# Altium schematic sheet MCU.SchDoc
size A3; SheetNumber: 2; SheetTotal: 5
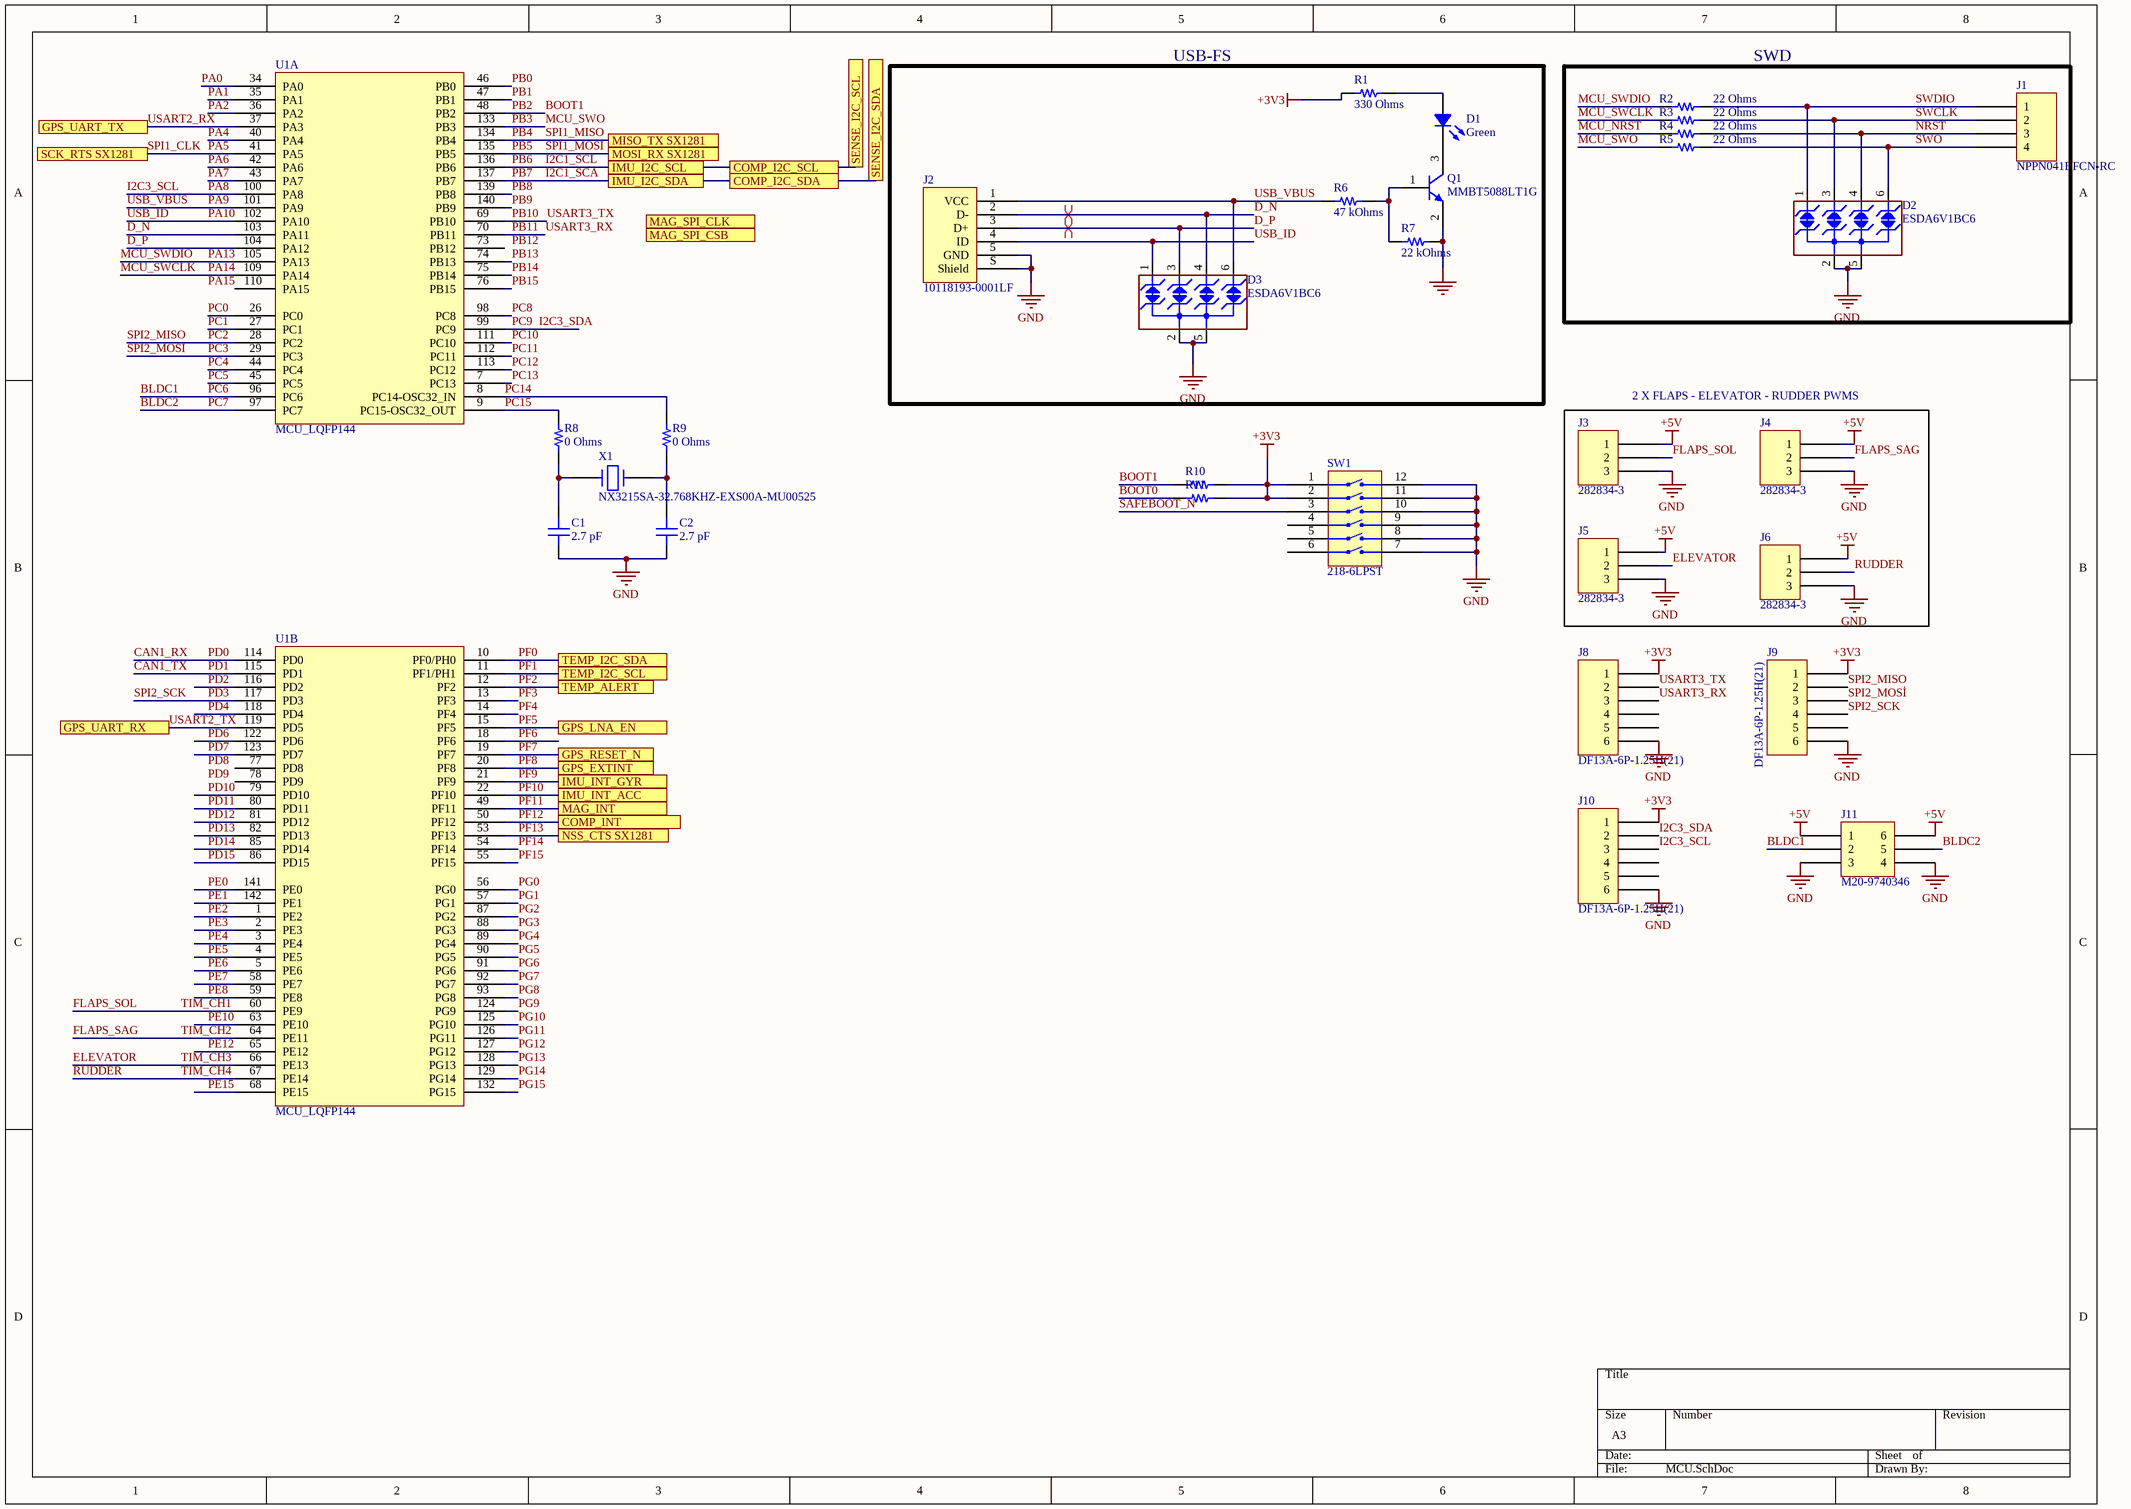
[diagram p0: MCU.SchDoc]

## Parts
C1  2.7 pF  [CAP 0603_1608]
C2  2.7 pF  [CAP 0603_1608]
D1  Green  [LED 0603_1608 GREEN]
D2  ESDA6V1BC6  [SOT23-6L_STM]
D3  ESDA6V1BC6  [SOT23-6L_STM]
J1  NPPN041BFCN-RC  [SULLINS NPPN041BFCN]
J2  10118193-0001LF  [FCI USB 10118193-0001LF]
J3  282834-3  [TE 282834-3]
J4  282834-3  [TE 282834-3]
J5  282834-3  [TE 282834-3]
J6  282834-3  [TE 282834-3]
J8  DF13A-6P-1.25H(21)  [HIROSE DF13A-6P-1.25H]
J9  DF13A-6P-1.25H(21)  [HIROSE DF13A-6P-1.25H]
J10  DF13A-6P-1.25H(21)  [HIROSE DF13A-6P-1.25H]
J11  M20-9740346  [HARWIN M20-9740345]
Q1  MMBT5088LT1G  [ON SEMI SOT-23-3]
R1  330 Ohms  [RES 0603_1608]
R2  22 Ohms  [RES 0603_1608]
R3  22 Ohms  [RES 0603_1608]
R4  22 Ohms  [RES 0603_1608]
R5  22 Ohms  [RES 0603_1608]
R6  47 kOhms  [RES 0603_1608]
R7  22 kOhms  [RES 0603_1608]
R8  0 Ohms  [RES 0603_1608]
R9  0 Ohms  [RES 0603_1608]
R10  100 kOhms  [RES 0603_1608]  (value not drawn)
R11  10 kOhms  [RES 0603_1608]  (value not drawn)
SW1  218-6LPST  [CTS 218-6LPJ]
U1  MCU_LQFP144  [LQFP144_0R5_SKT]  (parts A,B of 3)
X1  NX3215SA-32.768KHZ-EXS00A-MU00525  [XTAL_NX3215SA-32.768KHZ-EXS00A-MU00525_NDK]

## Blocks framed on the sheet
USB-FS: D1 D3 J2 Q1 R1 R6 R7
SWD: D2 J1 R2-R5
2 X FLAPS - ELEVATOR - RUDDER PWMS: J3-J6

## Ports
COMP_I2C_SCL, COMP_I2C_SDA, COMP_INT, GPS_EXTINT, GPS_LNA_EN, GPS_RESET_N, GPS_UART_RX, GPS_UART_TX, IMU_I2C_SCL, IMU_I2C_SDA, IMU_INT_ACC, IMU_INT_GYR, MAG_INT, MAG_SPI_CLK, MAG_SPI_CSB, MISO_TX SX1281, MOSI_RX SX1281, NSS_CTS SX1281, SCK_RTS SX1281, SENSE_I2C_SCL, SENSE_I2C_SDA, TEMP_ALERT, TEMP_I2C_SCL, TEMP_I2C_SDA

## Nets
+3V3: J8.1 J9.1 J10.1 R1.2 R10.2 R11.2 SW1.1(GND) SW1.2(GND)
+5V: J3.1 J4.1 J5.1 J6.1 J11.1 J11.6
GND: C1.1 C2.1 D2.2(IO2) D2.5(IO4) D3.2(IO2) D3.5(IO4) J2.5(GND) J2.S(Shield) J3.3 J4.3 J5.3 J6.3 J8.6 J9.6 J10.6 J11.3 J11.4 Q1.2(E) R7.2 SW1.7 SW1.8 SW1.9 SW1.10 SW1.11 SW1.12
BLDC1: J11.2 U1.96(PC6)  [also labelled PC6]
BLDC2: J11.5 U1.97(PC7)  [also labelled PC7]
BOOT0: R11.1
BOOT1: R10.1 U1.48(PB2)  [also labelled PB2]
CAN1_RX: U1.114(PD0)  [also labelled PD0]
CAN1_TX: U1.115(PD1)  [also labelled PD1]
D_N: D3.4(IO3) J2.2(D-) U1.103(PA11)
D_P: D3.3(GND) J2.3(D+) U1.104(PA12)
ELEVATOR: J5.2 U1.66(PE13)  [also labelled TIM_CH3]
FLAPS_SAG: J4.2 U1.64(PE11)  [also labelled TIM_CH2]
FLAPS_SOL: J3.2 U1.60(PE9)  [also labelled TIM_CH1]
I2C1_SCA: U1.137(PB7) ; port IMU_I2C_SDA, port SENSE_I2C_SDA, port COMP_I2C_SDA  [also labelled PB7]
I2C1_SCL: U1.136(PB6) ; port IMU_I2C_SCL, port COMP_I2C_SCL, port SENSE_I2C_SCL  [also labelled PB6]
I2C3_SCL: J10.3 U1.100(PA8)  [also labelled PA8]
I2C3_SDA: J10.2 U1.99(PC9)  [also labelled PC9]
MCU_NRST: R4.1
MCU_SWCLK: R3.1 U1.109(PA14)  [also labelled PA14]
MCU_SWDIO: R2.1 U1.105(PA13)  [also labelled PA13]
MCU_SWO: R5.1 U1.133(PB3)  [also labelled PB3]
NRST: D2.4(IO3) J1.3 R4.2
PA0: U1.34(PA0)
PA1: U1.35(PA1)
PA2: U1.36(PA2)
PA4: U1.40(PA4)
PA5: U1.41(PA5) ; port SCK_RTS SX1281  [also labelled SPI1_CLK]
PA6: U1.42(PA6)
PA7: U1.43(PA7)
PA9: D3.6(NC) J2.1(VCC) R6.1 U1.101(PA9)  [also labelled USB_VBUS]
PA10: D3.1(IO1) J2.4(ID) U1.102(PA10)  [also labelled USB_ID]
PB0: U1.46(PB0)
PB1: U1.47(PB1)
PB4: U1.134(PB4) ; port MISO_TX SX1281  [also labelled SPI1_MISO]
PB5: U1.135(PB5) ; port MOSI_RX SX1281  [also labelled SPI1_MOSI]
PB8: U1.139(PB8)
PB9: U1.140(PB9)
PB10: J8.2 U1.69(PB10)  [also labelled USART3_TX]
PB11: J8.3 U1.70(PB11)  [also labelled USART3_RX]
PB13: U1.74(PB13)
PB14: U1.75(PB14)
PB15: U1.76(PB15)
PC0: U1.26(PC0)
PC1: U1.27(PC1)
PC2: J9.2 U1.28(PC2)  [also labelled SPI2_MISO]
PC3: J9.3 U1.29(PC3)  [also labelled SPI2_MOSİ]
PC4: U1.44(PC4)
PC5: U1.45(PC5)
PC8: U1.98(PC8)
PC10: U1.111(PC10)
PC11: U1.112(PC11)
PC12: U1.113(PC12)
PC13: U1.7(PC13)
PC14: R9.2 U1.8(PC14-OSC32_IN)
PC15: R8.2 U1.9(PC15-OSC32_OUT)
PD2: U1.116(PD2)
PD3: J9.4 U1.117(PD3)  [also labelled SPI2_SCK]
PD4: U1.118(PD4)
PD6: U1.122(PD6)
PD7: U1.123(PD7)
PD10: U1.79(PD10)
PD11: U1.80(PD11)
PD12: U1.81(PD12)
PD13: U1.82(PD13)
PD14: U1.85(PD14)
PD15: U1.86(PD15)
PE0: U1.141(PE0)
PE1: U1.142(PE1)
PE2: U1.1(PE2)
PE3: U1.2(PE3)
PE4: U1.3(PE4)
PE5: U1.4(PE5)
PE6: U1.5(PE6)
PE7: U1.58(PE7)
PE8: U1.59(PE8)
PE10: U1.63(PE10)
PE12: U1.65(PE12)
PE15: U1.68(PE15)
PF0: U1.10(PF0/PH0) ; port TEMP_I2C_SDA
PF1: U1.11(PF1/PH1) ; port TEMP_I2C_SCL
PF2: U1.12(PF2) ; port TEMP_ALERT
PF3: U1.13(PF3)
PF4: U1.14(PF4)
PF5: U1.15(PF5) ; port GPS_LNA_EN
PF6: U1.18(PF6)
PF7: U1.19(PF7) ; port GPS_RESET_N
PF8: U1.20(PF8) ; port GPS_EXTINT
PF9: U1.21(PF9) ; port IMU_INT_GYR
PF10: U1.22(PF10) ; port IMU_INT_ACC
PF11: U1.49(PF11) ; port MAG_INT
PF12: U1.50(PF12) ; port COMP_INT
PF13: U1.53(PF13) ; port NSS_CTS SX1281
PF14: U1.54(PF14)
PF15: U1.55(PF15)
PG0: U1.56(PG0)
PG1: U1.57(PG1)
PG2: U1.87(PG2)
PG3: U1.88(PG3)
PG4: U1.89(PG4)
PG5: U1.90(PG5)
PG6: U1.91(PG6)
PG7: U1.92(PG7)
PG8: U1.93(PG8)
PG9: U1.124(PG9)
PG10: U1.125(PG10)
PG11: U1.126(PG11)
PG12: U1.127(PG12)
PG13: U1.128(PG13)
PG14: U1.129(PG14)
PG15: U1.132(PG15)
RUDDER: J6.2 U1.67(PE14)  [also labelled TIM_CH4]
SAFEBOOT_N: SW1.3(GND)
SWCLK: D2.3(GND) J1.2 R3.2
SWDIO: D2.1(IO1) J1.1 R2.2
SWO: D2.6(NC) J1.4 R5.2
USART2_RX: U1.37(PA3) ; port GPS_UART_TX
USART2_TX: U1.119(PD5) ; port GPS_UART_RX
NetC1_2: C1.2 R8.1 X1.1
NetC2_2: C2.2 R9.1 X1.2
NetD1_1: D1.1 R1.1
NetD1_2: D1.2 Q1.3(C)
NetQ1_1: Q1.1(B) R6.2 R7.1

Not connected (* = marked no-connect by the designer): J8 4 5; J9 5; J10 4 5; SW1 4(GND) 5 6; U1 73(PB12) 77(PD8) 78(PD9) 110(PA15)

## Layout directives
differential pair; differential pair class diff90: D_N, D_P

## Notes on the sheet
- Labels drawn without touching a wire or pin: PA15, PB12, PD8, PD9

## Library data of the parts
C1 C2 = CC0603BRNPO9BN2R7: CAP CER 2.7PF 50V C0G/NPO 0603; manufacturer: Yageo; Temperature Coefficient: C0G, NP0; Tolerance: ±0.1pF; Part Number: CC0603BRNPO9BN2R7; Value: 2.7 pF; Applications: General Purpose; Capacitance: 2.7 pF; componentlink1description: Datasheet; componentlink1url: https://www.yageo.com/upload/media/product/productsearch/datasheet/mlcc/UPY-GP_NP0_16V-to-50V_17.pdf; componentlink2description: DigiKey Link; componentlink2url: https://www.digikey.com/en/products/detail/yageo/CC0603BRNPO9BN2R7/5883424; Device Package: 0603 (1608 Metric); lastupdated: 20.02.2023 20:07:46; Lifecycle Status: Active; Minimum Order: 1; Mounting Type: Surface Mount, MLCC; Operating Temperature: -55°C ~ 125°C; Package / Case: 0603 (1608 Metric); packaging: TapeAndReel; partid: 44743; Part Status: Active; price: 0.01; series: CC; Size / Dimension: 0.063" L x 0.031" W (1.60mm x 0.80mm); Supplier 1: DigiKey; Supplier Part Number 1: 311-3830-1-ND; Thickness (Max): 0.035" (0.90mm); Voltage - Rated: 50V
D1 = HSMG-C197: LED GREEN DIFFUSED CHIP SMD; Manufacturer: Broadcom Limited; Configuration: Standard; Current - Test: 20mA; Lens Color: White; Lens Size: 1.60mm x 0.80mm; Lens Style: Rectangle with Flat Top; Millicandela Rating: 15mcd; Viewing Angle: 130°; Voltage - Forward (Vf) (Typ): 2.2V; Wavelength - Dominant: 572nm; Wavelength - Peak: 570nm; Part Number: HSMG-C197; Color: Green; ComponentLink1Description: Datasheet; ComponentLink1URL: https://docs.broadcom.com/docs/AV02-0551EN; ComponentLink2Description: DigiKey Link; ComponentLink2URL: https://www.digikey.com/en/products/detail/broadcom-limited/HSMG-C197/1235343; Device Package: 0603 (1608 Metric); Height (Max): 0.40mm; LastUpdated: 20.06.2022 12:31:27; Lens Transparency: Diffused; Lifecycle Status: Active; Minimum Order: 1; Mounting Type: Surface Mount; Package / Case: 0603 (1608 Metric); Packaging: TapeAndReel; PartId: 585; Part Status: Active; Price: 0.07; Series: -; Size / Dimension: 1.60mm L x 0.80mm W; Supplier 1: DigiKey; Supplier Part Number 1: 516-2830-1-ND; Supplier Device Package: Chip LED; Value: Green
D2 D3 = ESDA6V1BC6: 4-line ESD protection; Manuf_1: STM; Manuf_Part_1: ESDA5V3L; Ref St: 9179034; Provided: ST; ECCN_US/EU: EAR99/NEC; Distrib: ST; Order: ESDA5V3L; Ordered by: STM
J1 = NPPN041BFCN-RC: CONN HDR 4POS 0.079 GOLD PCB; Manufacturer: Sullins Connector Solutions; Connector Type: Header; Contact Length - Post: 0.094" (2.40mm); Current Rating (Amps): 2A; Material Flammability Rating: UL94 V-0; Number of Positions: 4; Number of Positions Loaded: All; Pitch - Mating: 0.079" (2.00mm); Style: Board to Board; Part Number: NPPN041BFCN-RC; ComponentLink1Description: Datasheet; ComponentLink1URL: https://drawings-pdf.s3.amazonaws.com/10483.pdf; ComponentLink2Description: DigiKey Link; ComponentLink2URL: https://www.digikey.com/en/products/detail/sullins-connector-solutions/NPPN041BFCN-RC/804806; Contact Finish - Mating: Gold; Contact Finish - Post: Gold; Contact Finish Thickness - Mating: Flash; Contact Type: Female Socket; Fastening Type: Push-Pull; Insulation Color: Black; Insulation Height: 0.173" (4.40mm); LastUpdated: 21.06.2022 14:42:51; Lifecycle Status: Active; Minimum Order: 1; Mounting Type: Through Hole; Number of Rows: 1; Operating Temperature: -40°C ~ 105°C; Packaging: Tube; Part Status: Active; Price: 0.30; Series: -; Supplier 1: DigiKey; Supplier Part Number 1: S5751-04-ND; Termination: Solder
J2 = 10118193-0001LF: CONN RCPT USB2.0 MICRO B SMD R/A; Manufacturer: Amphenol ICC (FCI); Connector Type: USB - micro B; Current Rating (Amps): 1.8A per Contact; Gender: Receptacle; Mating Cycles: 10000; Number of Contacts: 5; Number of Ports: 1; Shielding: Shielded; Voltage - Rated: 100VAC; Part Number: 10118193-0001LF; ComponentLink1Description: Datasheet; ComponentLink1URL: https://cdn.amphenol-icc.com/media/wysiwyg/files/documentation/datasheet/inputoutput/io_usb_micro.pdf; ComponentLink2Description: DigiKey Link; ComponentLink2URL: //digikey.com/product-detail/en/amphenol-icc-fci/10118193-0001LF/609-4616-2-ND/2785388; Features: Solder Retention; LastUpdated: 9.12.2019 20:51:28; Lifecycle Status: 0; Minimum Order: 1; Mounting Feature: Horizontal; Mounting Type: Surface Mount, Right Angle; Through Hole; Operating Temperature: -30°C ~ 80°C; Packaging: TapeAndReel; Part Status: Active; Price: 0.21; Series: -; Specifications: USB 2.0; Supplier 1: DigiKey; Supplier Part Number 1: 609-4616-2-ND; Termination: Solder
J3-J6 = 282834-3: TERM BLK 3P SIDE ENT 2.54MM PCB; Manufacturer: TE Connectivity AMP Connectors; Current: 10A; Mating Orientation: Horizontal with Board; Number of Levels: 1; Pitch: 0.100" (2.54mm); Positions Per Level: 3; Voltage: 150V; Wire Gauge: 16-30 AWG; Wire Termination: Screw - Rising Cage Clamp; Part Number: 282834-3; Color: Green; ComponentLink1Description: Datasheet; ComponentLink1URL: https://www.te.com/commerce/DocumentDelivery/DDEController?Action=srchrtrv&DocNm=282834&DocType=Customer+Drawing&DocLang=English; ComponentLink2Description: DigiKey Link; ComponentLink2URL: http://digikey.com/product-detail/en/te-connectivity-amp-connectors/282834-3/A98334-ND/1153264; LastUpdated: 15.01.2020 04:15:50; Lifecycle Status: Active; Minimum Order: 1; Mounting Type: Through Hole; Packaging: Bulk; Part Status: Active; Price: 2.01; Series: Buchanan; Supplier 1: DigiKey; Supplier Part Number 1: A98334-ND
J8-J10 = DF13A-6P-1.25H(21): CONN HEADER SMD R/A 6POS 1.25MM; Manufacturer: Hirose Electric Co Ltd; Current Rating (Amps): 1A; Material Flammability Rating: UL94 V-0; Number of Positions: 6; Number of Positions Loaded: All; Pitch - Mating: 0.049" (1.25mm); Shrouding: Shrouded - 4 Wall; Style: Board to Cable/Wire; Voltage Rating: 150V; Part Number: DF13A-6P-1.25H(21); ComponentLink1Description: Datasheet; ComponentLink1URL: https://www.hirose.com/product/download/?distributor=digikey&type=specSheet&lang=en&num=DF13A-6P-1.25H(21); ComponentLink2Description: DigiKey Link; ComponentLink2URL: http://digikey.com/product-detail/en/hirose-electric-co-ltd/DF13A-6P-1.25H-21/H125991CT-ND/9489729; Connector Type: Header; Contact Finish - Mating: Tin; Contact Finish - Post: Tin; Contact Material: Brass; Contact Shape: Square; Contact Type: Male Pin; Fastening Type: Detent Lock; Features: Solder Retention; Insulation Color: Beige; Insulation Height: 0.142" (3.60mm); Insulation Material: Polyamide (PA), Nylon; LastUpdated: 15.01.2020 03:36:36; Lifecycle Status: Active; Minimum Order: 1; Mounting Type: Surface Mount, Right Angle; Number of Rows: 1; Operating Temperature: -35°C ~ 85°C; Packaging: TapeAndReel; PartId: 110; Part Status: Active; Price: 0.32; Series: DF13; Supplier 1: DigiKey; Supplier Part Number 1: H125991CT-ND; Termination: Solder
J11 = M20-9740346: CONN HEADER R/A 6POS 2.54MM; Manufacturer: Harwin Inc.; Connector Type: Header, Cuttable; Current Rating (Amps): 3A per Contact; Material Flammability Rating: UL94 V-0; Number of Positions: 6; Number of Positions Loaded: All; Shrouding: Unshrouded; Style: Board to Board or Cable; Part Number: M20-9740346; ComponentLink1Description: Datasheet; ComponentLink1URL: https://cdn.harwin.com/pdfs/M20-974.pdf; ComponentLink2Description: DigiKey Link; ComponentLink2URL: http://digikey.com/product-detail/en/harwin-inc/M20-9740346/M20-9740346-ND/3920713; Contact Finish - Mating: Tin; Contact Finish - Post: Tin; Contact Material: Brass; Contact Shape: Square; Contact Type: Male Pin; Fastening Type: Push-Pull; Insulation Color: Black; Insulation Material: Polyamide (PA6T), Nylon 6T; LastUpdated: 21.09.2022 19:29:59; Lifecycle Status: Active; Minimum Order: 4000; Mounting Type: Through Hole, Right Angle; Number of Rows: 2; Operating Temperature: -40°C ~ 105°C; Packaging: Bulk; PartId: 156; Part Status: Active; Price: 0.10; Series: M20; Supplier 1: DigiKey; Supplier Part Number 1: M20-9740346-ND; Termination: Solder
Q1 = MMBT5088LT1G: TRANS NPN 30V 0.05A SOT23; Manufacturer: ON Semiconductor; Current - Collector Cutoff (Max): 50nA (ICBO); Current - Collector (Ic) (Max): 50mA; DC Current Gain (hFE) (Min) @ Ic, Vce: 300 @ 100µA, 5V; Frequency - Transition: 50MHz; Power - Max: 300mW; Vce Saturation (Max) @ Ib, Ic: 500mV @ 1mA, 10mA; Part Number: MMBT5088LT1G; ComponentLink1Description: Datasheet; ComponentLink1URL: http://www.onsemi.com/pub/Collateral/MMBT5088LT1-D.PDF; ComponentLink2Description: DigiKey Link; ComponentLink2URL: http://digikey.com/product-detail/en/on-semiconductor/MMBT5088LT1G/MMBT5088LT1GOSCT-ND/1139822; LastUpdated: 20.06.2022 12:43:40; Lifecycle Status: Active; Minimum Order: 1; Mounting Type: Surface Mount; Operating Temperature: -55°C ~ 150°C (TJ); Package / Case: TO-236-3, SC-59, SOT-23-3; Packaging: TapeAndReel; PartId: 231; Part Status: Active; Price: 0.03; Series: -; Supplier 1: DigiKey; Supplier Part Number 1: MMBT5088LT1GOSCT-ND; Supplier Device Package: SOT-23-3 (TO-236); Transistor Type: NPN; Voltage - Collector Emitter Breakdown (Max): 30V
R1 = RC0603FR-07330RL: RES 330 OHM 1% 1/10W 0603; Manufacturer: Yageo; Power (Watts): 0.1W, 1/10W; Temperature Coefficient: ±100ppm/°C; Part Number: RC0603FR-07330RL; Value: 330 Ohms; ComponentLink1Description: Datasheet; ComponentLink1URL: https://www.yageo.com/upload/media/product/productsearch/datasheet/rchip/PYu-RC_Group_51_RoHS_L_10.pdf; ComponentLink2Description: DigiKey Link; ComponentLink2URL: https://www.digikey.com/en/products/detail/yageo/RC0603FR-07330RL/727162; Composition: Thick Film; Device Package: 0603 (1608 Metric); Features: Moisture Resistant; Height - Seated (Max): 0.022" (0.55mm); LastUpdated: 20.06.2022 12:09:48; Lifecycle Status: Active; Minimum Order: 1; Number of Terminations: 2; Operating Temperature: -55°C ~ 155°C; Package / Case: 0603 (1608 Metric); Packaging: CutTape; PartId: 23956; Part Status: Active; Price: 0.01; Resistance: 330 Ohms; Series: RC_L; Size / Dimension: 0.063" L x 0.031" W (1.60mm x 0.80mm); Supplier 1: DigiKey; Supplier Part Number 1: 311-330HRCT-ND; Supplier Device Package: 0603; Tolerance: ±1%
R2-R5 = RC0603FR-0722RL: RES 22 OHM 1% 1/10W 0603; Manufacturer: Yageo; Power (Watts): 0.1W, 1/10W; Temperature Coefficient: ±100ppm/°C; Part Number: RC0603FR-0722RL; Value: 22 Ohms; ComponentLink1Description: Datasheet; ComponentLink1URL: https://www.yageo.com/upload/media/product/productsearch/datasheet/rchip/PYu-RC_Group_51_RoHS_L_10.pdf; ComponentLink2Description: DigiKey Link; ComponentLink2URL: https://www.digikey.com/en/products/detail/yageo/RC0603FR-0722RL/727055; Composition: Thick Film; Device Package: 0603 (1608 Metric); Features: Moisture Resistant; Height - Seated (Max): 0.022" (0.55mm); LastUpdated: 11.08.2022 09:13:21; Lifecycle Status: Active; Minimum Order: 1; Number of Terminations: 2; Operating Temperature: -55°C ~ 155°C; Package / Case: 0603 (1608 Metric); Packaging: CutTape; PartId: 18963; Part Status: Active; Price: 0.01; Resistance: 22 Ohms; Series: RC_L; Size / Dimension: 0.063" L x 0.031" W (1.60mm x 0.80mm); Supplier 1: DigiKey; Supplier Part Number 1: 311-22.0HRCT-ND; Supplier Device Package: 0603; Tolerance: ±1%
R6 = RC0603FR-0747KL: RES 47K OHM 1% 1/10W 0603; Manufacturer: Yageo; Power (Watts): 0.1W, 1/10W; Temperature Coefficient: ±100ppm/°C; Part Number: RC0603FR-0747KL; Value: 47 kOhms; ComponentLink1Description: Datasheet; ComponentLink1URL: https://www.yageo.com/upload/media/product/productsearch/datasheet/rchip/PYu-RC_Group_51_RoHS_L_10.pdf; ComponentLink2Description: DigiKey Link; ComponentLink2URL: https://www.digikey.com/en/products/detail/yageo/RC0603FR-0747KL/727253; Composition: Thick Film; Device Package: 0603 (1608 Metric); Features: Moisture Resistant; Height - Seated (Max): 0.022" (0.55mm); LastUpdated: 20.06.2022 12:09:54; Lifecycle Status: Active; Minimum Order: 1; Number of Terminations: 2; Operating Temperature: -55°C ~ 155°C; Package / Case: 0603 (1608 Metric); Packaging: CutTape; PartId: 22601; Part Status: Active; Price: 0.01; Resistance: 47 kOhms; Series: RC_L; Size / Dimension: 0.063" L x 0.031" W (1.60mm x 0.80mm); Supplier 1: DigiKey; Supplier Part Number 1: 311-47.0KHRCT-ND; Supplier Device Package: 0603; Tolerance: ±1%
R7 = RC0603FR-0722KL: RES 22K OHM 1% 1/10W 0603; Manufacturer: Yageo; Power (Watts): 0.1W, 1/10W; Temperature Coefficient: ±100ppm/°C; Part Number: RC0603FR-0722KL; Value: 22 kOhms; ComponentLink1Description: Datasheet; ComponentLink1URL: https://www.yageo.com/upload/media/product/productsearch/datasheet/rchip/PYu-RC_Group_51_RoHS_L_10.pdf; ComponentLink2Description: DigiKey Link; ComponentLink2URL: https://www.digikey.com/en/products/detail/yageo/RC0603FR-0722KL/727056; Composition: Thick Film; Device Package: 0603 (1608 Metric); Features: Moisture Resistant; Height - Seated (Max): 0.022" (0.55mm); LastUpdated: 20.06.2022 12:10:04; Lifecycle Status: Active; Minimum Order: 1; Number of Terminations: 2; Operating Temperature: -55°C ~ 155°C; Package / Case: 0603 (1608 Metric); Packaging: CutTape; PartId: 18937; Part Status: Active; Price: 0.01; Resistance: 22 kOhms; Series: RC_L; Size / Dimension: 0.063" L x 0.031" W (1.60mm x 0.80mm); Supplier 1: DigiKey; Supplier Part Number 1: 311-22.0KHRCT-ND; Supplier Device Package: 0603; Tolerance: ±1%
R8 R9 = RC0603JR-070RL: RES 0 OHM JUMPER 1/10W 0603; Manufacturer: Yageo; Power (Watts): 0.1W, 1/10W; Part Number: RC0603JR-070RL; Value: 0 Ohms; ComponentLink1Description: Datasheet; ComponentLink1URL: https://www.yageo.com/upload/media/product/productsearch/datasheet/rchip/PYu-RC_Group_51_RoHS_L_10.pdf; ComponentLink2Description: DigiKey Link; ComponentLink2URL: https://www.digikey.com/en/products/detail/yageo/RC0603JR-070RL/726675; Composition: Thick Film; Device Package: 0603 (1608 Metric); Features: Moisture Resistant; Height - Seated (Max): 0.022" (0.55mm); LastUpdated: 20.02.2023 20:28:09; Lifecycle Status: Active; Minimum Order: 1; Number of Terminations: 2; Operating Temperature: -55°C ~ 155°C; Package / Case: 0603 (1608 Metric); Packaging: CutTape; PartId: 22595; Part Status: Active; Price: 0.01; Resistance: 0 Ohms; Series: RC_L; Size / Dimension: 0.063" L x 0.031" W (1.60mm x 0.80mm); Supplier 1: DigiKey; Supplier Part Number 1: 311-0.0GRCT-ND; Supplier Device Package: 0603; Tolerance: Jumper
R10 = RC0603FR-07100KL: RES 100K OHM 1% 1/10W 0603; Manufacturer: Yageo; Power (Watts): 0.1W, 1/10W; Temperature Coefficient: ±100ppm/°C; Part Number: RC0603FR-07100KL; Value: 100 kOhms; ComponentLink1Description: Datasheet; ComponentLink1URL: https://www.yageo.com/upload/media/product/productsearch/datasheet/rchip/PYu-RC_Group_51_RoHS_L_10.pdf; ComponentLink2Description: DigiKey Link; ComponentLink2URL: https://www.digikey.com/en/products/detail/yageo/RC0603FR-07100KL/726889; Composition: Thick Film; Device Package: 0603 (1608 Metric); Features: Moisture Resistant; Height - Seated (Max): 0.022" (0.55mm); LastUpdated: 8.03.2023 20:28:53; Lifecycle Status: Active; Minimum Order: 1; Number of Terminations: 2; Operating Temperature: -55°C ~ 155°C; Package / Case: 0603 (1608 Metric); Packaging: CutTape; PartId: 23948; Part Status: Active; Price: 0.01; Resistance: 100 kOhms; Series: RC_L; Size / Dimension: 0.063" L x 0.031" W (1.60mm x 0.80mm); Supplier 1: DigiKey; Supplier Part Number 1: 311-100KHRCT-ND; Supplier Device Package: 0603; Tolerance: ±1%
R11 = RC0603FR-0710KL: RES 10K OHM 1% 1/10W 0603; Manufacturer: Yageo; Power (Watts): 0.1W, 1/10W; Temperature Coefficient: ±100ppm/°C; Part Number: RC0603FR-0710KL; Value: 10 kOhms; ComponentLink1Description: Datasheet; ComponentLink1URL: https://www.yageo.com/upload/media/product/productsearch/datasheet/rchip/PYu-RC_Group_51_RoHS_L_10.pdf; ComponentLink2Description: DigiKey Link; ComponentLink2URL: https://www.digikey.com/en/products/detail/yageo/RC0603FR-0710KL/726880; Composition: Thick Film; Device Package: 0603 (1608 Metric); Features: Moisture Resistant; Height - Seated (Max): 0.022" (0.55mm); LastUpdated: 8.03.2023 20:29:05; Lifecycle Status: Active; Minimum Order: 1; Number of Terminations: 2; Operating Temperature: -55°C ~ 155°C; Package / Case: 0603 (1608 Metric); Packaging: CutTape; PartId: 22599; Part Status: Active; Price: 0.01; Resistance: 10 kOhms; Series: RC_L; Size / Dimension: 0.063" L x 0.031" W (1.60mm x 0.80mm); Supplier 1: DigiKey; Supplier Part Number 1: 311-10.0KHRCT-ND; Supplier Device Package: 0603; Tolerance: ±1%
SW1 = 218-6LPST: SWITCH SLIDE DIP SPST 25MA 24V; Manufacturer: CTS Electrocomponents; Actuator Level: Flush, Recessed; Actuator Type: Slide (Standard); Number of Positions: 6; Pitch: 0.050" (1.27mm), Half; Voltage Rating: 24VDC; Washable: Yes; Part Number: 218-6LPST; Circuit: SPST; ComponentLink1Description: Datasheet; ComponentLink1URL: https://www.ctscorp.com/wp-content/uploads/218.pdf; ComponentLink2Description: DigiKey Link; ComponentLink2URL: http://digikey.com/product-detail/en/cts-electrocomponents/218-6LPST/CT2186LPST-ND/267321; Contact Finish: Gold; Contact Material: Beryllium Copper; Current Rating (Amps): 25mA; Features: Epoxy Sealed Terminals, Tape Seal; Height Above Board: 0.104" (2.65mm); LastUpdated: 4.01.2020 18:55:14; Lifecycle Status: Active; Minimum Order: 1; Mounting Type: Surface Mount; Operating Temperature: -55°C ~ 85°C; Packaging: Tube; PartId: 12; Part Status: Active; Price: 1.32; Series: 218; Supplier 1: DigiKey; Supplier Part Number 1: CT2186LPST-ND; Termination Style: Gull Wing
X1 = CRYSTAL_32K: Crystal